# Altium schematic sheet Sensor_Box_CAN_Switch_STM.SchDoc: Title
size 420 x 297 mm; Author: G.Kasprowicz; CompanyName: WUT ISE; DrawnBy: G.Kasprowicz; Organization: WUT ISE; Address1: PW ISE; Address2: Nowowiejska 15/19 00-665 Warsaw; Address3: gkasprow@gmail.com; Revision: 1.0; SheetNumber: -; SheetTotal: -; ModifiedBy: -; CheckedDate: -; Title2: Title2; DivGrp: WUT ISE; Designer: G.Kasprowicz; ModifiedDate: -; ProjectName: Sensor Box
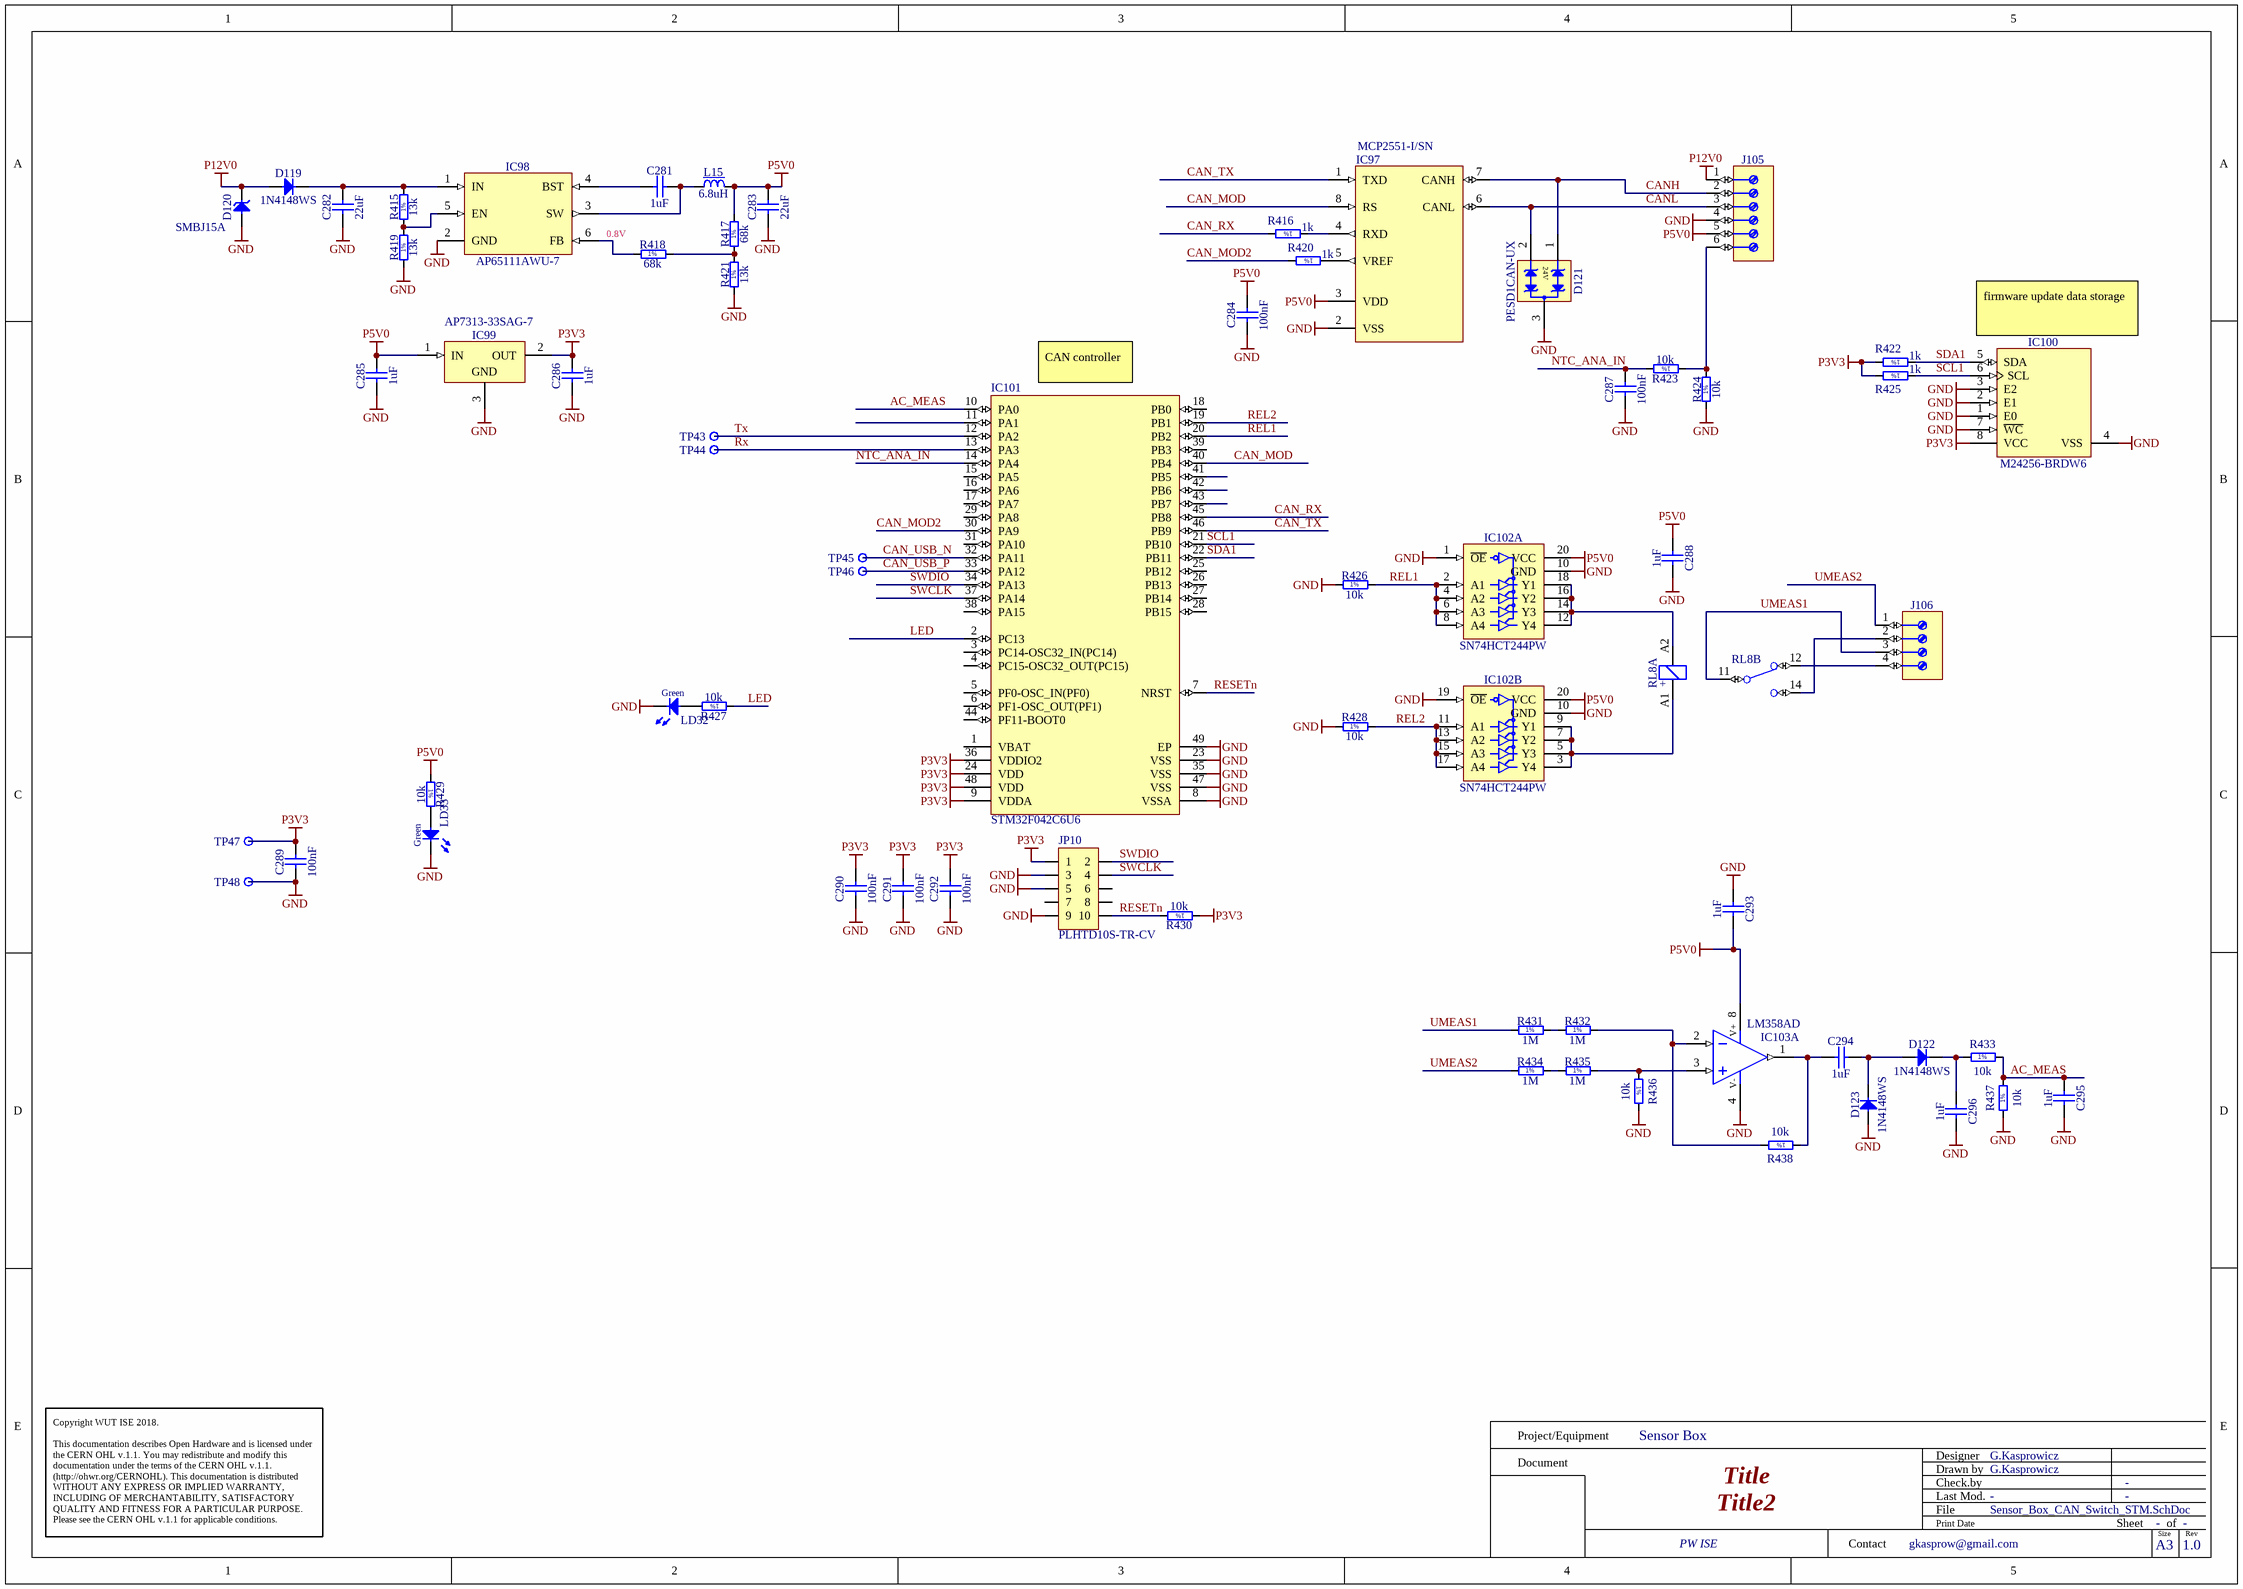
[diagram p0: Sensor_Box_CAN_Switch_STM.SchDoc]

## Parts
C281  1uF  [CAPC1005X55N]
C282  22uF  [CAPC1709X100N]
C283  22uF  [CAPC1709X100N]
C284  100nF  [CAPC1005X55N]
C285  1uF  [CAPC1005X55N]
C286  1uF  [CAPC1005X55N]
C287  100nF  [CAPC1005X55N]
C288  1uF  [CAPC1005X55N]
C289  100nF  [CAPC1005X55N]
C290  100nF  [CAPC1005X55N]
C291  100nF  [CAPC1005X55N]
C292  100nF  [CAPC1005X55N]
C293  1uF  [CAPC1005X55N]
C294  1uF  [CAPC1005X55N]
C295  1uF  [CAPC1005X55N]
C296  1uF  [CAPC1005X55N]
D119  1N4148WS  [SODFL2512X100N]
D120  SMBJ15A  [DIOM5336X265N]
D121  PESD1CAN-UX  [SOT95P237X112-3N]
D122  1N4148WS  [SODFL2512X100N]
D123  1N4148WS  [SODFL2512X100N]
IC97  MCP2551-I/SN  [SOIC127P600X175-8N]
IC98  AP65111AWU-7  [SOT95P280X100-6N]
IC99  AP7313-33SAG-7  [SOT95P240X130-3N]
IC100  M24256-BRDW6  [SOP65P640X120-8N]
IC101  STM32F042C6U6  [STM-UFQFPN48_L]
IC102  SN74HCT244PW  [SOP65P640X120-20N]  (parts A,B of 2)
IC103  LM358AD  [SOIC127P600X175-8N]  (part A of 2)
J105  (no value)  [PHOENIX_1725698]
J106  (no value)  [TYCO_282836-4]
JP10  PLHTD10S-TR-CV  [PLHTD10S-TR-CV]
L15  6.8uH  [IND_WALSIN_WLPN3030]
LD32  Green  [LED_KINGBRIGHT_KPH-1608CGCK]
LD33  Green  [LED_KINGBRIGHT_KPH-1608CGCK]
R415  13k  [RESC1005X40N]
R416  1k  [RESC1005X40N]
R417  68k  [RESC1005X40N]
R418  68k  [RESC1005X40N]
R419  13k  [RESC1005X40N]
R420  1k  [RESC1005X40N]
R421  13k  [RESC1005X40N]
R422  1k  [RESC1005X40N]
R423  10k  [RESC1005X40N]
R424  10k  [RESC1005X40N]
R425  1k  [RESC1005X40N]
R426  10k  [RESC1005X40N]
R427  10k  [RESC1005X40N]
R428  10k  [RESC1005X40N]
R429  10k  [RESC1005X40N]
R430  10k  [RESC1005X40N]
R431  1M  [RESC3216X65N]
R432  1M  [RESC3216X65N]
R433  10k  [RESC1005X40N]
R434  1M  [RESC3216X65N]
R435  1M  [RESC3216X65N]
R436  10k  [RESC1005X40N]
R437  10k  [RESC1005X40N]
R438  10k  [RESC1005X40N]
RL8  REL_TYCO_PE01  [REL_TYCO_PE01]  (value not drawn)  (parts A,B of 2)
TP43  Test Point  [TPS127]  (value not drawn)
TP44  Test Point  [TPS127]  (value not drawn)
TP45  Test Point  [TPS127]  (value not drawn)
TP46  Test Point  [TPS127]  (value not drawn)
TP47  Test Point  [TPS127]  (value not drawn)
TP48  Test Point  [TPS127]  (value not drawn)

## Nets
GND: C282.1 C283.1 C284.1 C285.1 C286.1 C287.1 C288.2 C289.1 C290.1 C291.1 C292.1 C293.1 C295.2 C296.2 D120.2(A) D121.3(GND) D123.2(A) IC97.2(VSS) IC98.2(GND) IC99.3(GND) IC100.1(E0) IC100.2(E1) IC100.3(E2) IC100.4(VSS) IC100.7(~{WC}) IC101.8(VSSA) IC101.23(VSS) IC101.35(VSS) IC101.47(VSS) IC101.49(EP) IC102.1(~{OE}) IC102.10(GND) IC102.19(~{OE}) IC103.4(V-) J105.4 JP10.3 JP10.5 JP10.9 LD32.1(C) LD33.1(C) R419.1 R421.1 R424.1 R426.1 R428.1 R436.2 R437.1 TP48.1
P3V3: C286.2 C289.2 C290.2 C291.2 C292.2 IC99.2(OUT) IC100.8(VCC) IC101.9(VDDA) IC101.24(VDD) IC101.36(VDDIO2) IC101.48(VDD) JP10.1 R422.2 R425.2 R430.1 TP47.1
P5V0: C283.2 C284.2 C285.2 C288.1 C293.2 IC97.3(VDD) IC99.1(IN) IC102.20(VCC) IC103.8(V+) J105.5 L15.2 R417.2 R429.1
P12V0: D119.2(A) D120.1(C) J105.1
AC_MEAS: C295.1 IC101.10(PA0) R433.2 R437.2
CAN_MOD: IC97.8(RS) IC101.40(PB4)
CAN_MOD2: IC101.30(PA9) R420.2
CAN_RX: IC101.45(PB8) R416.2
CAN_TX: IC97.1(TXD) IC101.46(PB9)
CAN_USB_N: IC101.32(PA11) TP45.1
CAN_USB_P: IC101.33(PA12) TP46.1
CANH: D121.1(I/O1) IC97.7(CANH) J105.2
CANL: D121.2(I/O2) IC97.6(CANL) J105.3
LED: IC101.2(PC13) R427.1
NTC_ANA_IN: C287.2 IC101.14(PA4) R423.2
REL1: IC101.20(PB2) IC102.2(A1) IC102.4(A2) IC102.6(A3) IC102.8(A4) R426.2
REL2: IC101.19(PB1) IC102.11(A1) IC102.13(A2) IC102.15(A3) IC102.17(A4) R428.2
RESETn: IC101.7(NRST) JP10.10 R430.2
Rx: IC101.13(PA3) TP44.1
SCL1: IC100.6(SCL) IC101.21(PB10) R425.1
SDA1: IC100.5(SDA) IC101.22(PB11) R422.1
SWCLK: IC101.37(PA14) JP10.4
SWDIO: IC101.34(PA13) JP10.2
Tx: IC101.12(PA2) TP43.1
UMEAS1: J106.3 R431.1 RL8.11(C)
UMEAS2: J106.1 R434.1
NetC281_1: C281.1 IC98.4(BST)
NetC281_2: C281.2 IC98.3(SW) L15.1
NetC282_2: C282.2 D119.1(C) IC98.1(IN) R415.2
NetC294_1: C294.1 IC103.1(OUT) R438.1
NetC294_2: C294.2 D122.2(A) D123.1(C)
NetC296_1: C296.1 D122.1(C) R433.1
NetIC97_4: IC97.4(RXD) R416.1
NetIC97_5: IC97.5(VREF) R420.1
NetIC98_5: IC98.5(EN) R415.1 R419.2
NetIC98_6: IC98.6(FB) R418.1
NetIC102_3: IC102.3(Y4) IC102.5(Y3) IC102.7(Y2) IC102.9(Y1) RL8.A1
NetIC102_12: IC102.12(Y4) IC102.14(Y3) IC102.16(Y2) IC102.18(Y1) RL8.A2
NetIC103_2: IC103.2(IN-) R432.2 R438.2
NetIC103_3: IC103.3(IN+) R435.2 R436.1
NetJ105_6: J105.6 R423.1 R424.2
NetJ106_2: J106.2 RL8.14(NO)
NetJ106_4: J106.4 RL8.12(NC)
NetLD32_2: LD32.2(A) R427.2
NetLD33_2: LD33.2(A) R429.2
NetR417_1: R417.1 R418.2 R421.2
NetR431_2: R431.2 R432.1
NetR434_2: R434.2 R435.1

Not connected (* = marked no-connect by the designer): IC101 1(VBAT) 3(PC14-OSC32_IN(PC14)) 4(PC15-OSC32_OUT(PC15)) 5(PF0-OSC_IN(PF0)) 6(PF1-OSC_OUT(PF1)) 11(PA1) 15(PA5) 16(PA6) 17(PA7) 18(PB0) 25(PB12) 26(PB13) 27(PB14) 28(PB15) 29(PA8) 31(PA10) 38(PA15) 39(PB3) 41(PB5) 42(PB6) 43(PB7) 44(PF11-BOOT0); JP10 6 7 8

## Notes on the sheet
- 0.8V
- (near IC101) CAN controller
- (near IC100) firmware update data storage
- Project/Equipment
- Document
- Designer
- Drawn by
- Check.by
- Copyright WUT ISE 2018.
  This documentation describes Open Hardware and is licensed under the CERN OHL v.1.1. You may redistribute and modify this documentation under the terms of the CERN OHL v.1.1. (http://ohwr.org/CERNOHL). This documentation is distributed WITHOUT ANY EXPRESS OR IMPLIED WARRANTY, INCLUDING OF MERCHANTABILITY, SATISFACTORY QUALITY AND FITNESS FOR A PARTICULAR PURPOSE. Please see the CERN OHL v.1.1 for applicable conditions.
- Contact
- File
- Last Mod.
- Print Date
- Sheet
- Size
- A3
- of
- Rev
- (in symbol R0402_1K_1%_0.0625W_100PPM) 1%
- (in symbol R0402_10K_1%_0.0625W_100PPM) 1%
- (in symbol R0402_13K_1%_0.0625W_100PPM) 1%
- (in symbol R0402_68K_1%_0.0625W_100PPM) 1%
- (in symbol R1206_1M_1%_0.25W_100PPM) 1%
- (in symbol REL_TYCO_PE014F05, part A) +

## Library data of the parts
C281 C285 C286 C288 C293-C296 = CC0402_1UF_16V_10%_X5R: Non-polarised capacitor; Part Description: SMD Multilayer Chip Ceramic Capacitor; Manufacturer: GENERIC; Manufacturer1 Part Number: C1005X5R1C105KT; Voltage: 16V; TC: X5R; Tolerance: ±10%; Part Number: CC0402_1UF_16V_10%_X5R; Component Kind: Standard; Component Type: Standard; Pin Count: 2; Value: 1uF; Status: Preferred; Manufacturer Part Number: CC0402_1UF_16V_10%_X5R; Case: 0402; Mounted: Yes; Socket: No; SMD: Yes; Sense: No; Manufacturer1 Example: TDK; Manufacturer1 ComponentHeight: 0.55mm; HelpURL: \\cern.ch\dfs\Applications\Altium\Datasheets\CC0402_X5R_TDK_C.pdf; Author: CERN DEM JLC; CreateDate: 25.10.2012; LatestRevisionDate: 25.10.2012
C282 C283 = CC0603_22UF_6.3V_20%_X5R: Non-polarised capacitor; Part Description: SMD Multilayer Chip Ceramic Capacitor; Manufacturer: GENERIC; Manufacturer1 Part Number: C1608X5R0J226M080AC; Voltage: 6.3V; TC: X5R; Tolerance: ±20%; Part Number: CC0603_22UF_6.3V_20%_X5R; Component Kind: Standard; Component Type: Standard; Pin Count: 2; Value: 22uF; Status: None; Manufacturer Part Number: CC0603_22UF_6.3V_20%_X5R; Case: 0603; Mounted: Yes; Socket: No; SMD: Yes; Sense: No; Manufacturer1 Example: TDK; Manufacturer1 ComponentHeight: 1mm; HelpURL: \\cern.ch\dfs\Applications\Altium\Datasheets\CC0603_X5R_TDK_C.pdf; Author: CERN DEM JLC; CreateDate: 16.12.2013; LatestRevisionDate: 13.09.2016
C284 C287 C289-C292 = CC0402_100NF_16V_10%_X5R: Non-polarised capacitor; Part Description: SMD Multilayer Chip Ceramic Capacitor; Manufacturer: GENERIC; Manufacturer1 Part Number: GRM155R61C104KA88D; Voltage: 16V; TC: X5R; Tolerance: ±10%; Part Number: CC0402_100NF_16V_10%_X5R; Component Kind: Standard; Component Type: Standard; Pin Count: 2; Value: 100nF; Status: None; Manufacturer Part Number: CC0402_100NF_16V_10%_X5R; Case: 0402; Mounted: Yes; Socket: No; SMD: Yes; Sense: No; Manufacturer1 Example: MURATA; Manufacturer1 ComponentHeight: 0.55mm; HelpURL: \\cern.ch\dfs\Applications\Altium\Datasheets\CC0402_X5R_MURATA_GRM.pdf; Author: CERN DEM JLC; CreateDate: 10.12.2013; LatestRevisionDate: 10.12.2013
D119 D122 D123 = 1N4148WS: Diode; Part Description: Small Signal Diodes; Manufacturer: FAIRCHILD SEMICONDUCTOR; Voltage: 75V; Power: 150mA; PressFit: No; Bonding: No; Part Number: 1N4148WS; Component Kind: Standard; Component Type: Standard; Device: 1N4148WS; PackageDescription: SODFL Diode; 1.70mm W X 1.25mm L X 1.00mm H body, IPC Medium Density; Manufacturer Part Number: 1N4148WS; Pin Count: 2; Case: SOD-323F; Mounted: Yes; Socket: No; SMD: Yes; Sense: No; ComponentHeight: 1mm; HelpURL: \\cern.ch\dfs\Applications\Altium\Datasheets\1N4148WS.pdf; Author: CERN DEM JLC; CreateDate: 12.05.2011; LatestRevisionDate: 12.05.2011
D120 = SMBJ15A: Zener Diode; Part Description: Uni-Directional Transient Voltage Suppressor Diode; Manufacturer: FAIRCHILD SEMICONDUCTOR; Voltage: 15V; Power: 600W; PressFit: No; Bonding: No; Part Number: SMBJ15A; Component Kind: Standard; Component Type: Standard; Device: SMBJ15A; PackageDescription: DO-214-AA/SMB Diode, Molded Body; 5.34mm L X 3.625mm W X 2.65mm H, IPC Medium Density; Manufacturer Part Number: SMBJ15A; Pin Count: 2; Case: DO-214AA; Mounted: Yes; Socket: No; SMD: Yes; Sense: No; ComponentHeight: 2.65mm; HelpURL: \\cern.ch\dfs\Applications\Altium\Datasheets\SMBJ.pdf; Author: CERN DEM JLC; CreateDate: 08.12.2008; LatestRevisionDate: 19.12.2011
D121 = D_TVS_PESD1CAN: TVS Diode for CAN; Manufacturer: Nexperia; Voltage: 24V; Power: 400W; PressFit: No; Bonding: No; Part Number: PESD1CAN-UX; Component Kind: Standard; Component Type: Standard; Device: PESD1CAN-UX; PackageDescription: SOT, 0.95mm, pitch; 3 pin,1.30mm W X 2.92mm L X 1.12mm H body, IPC Medium Density; Part Description: TVS Diode for CAN; Manufacturer Part Number: PESD1CAN-UX; Pin Count: 3; Case: SOT-23; Mounted: Yes; Socket: No; SMD: Yes; Sense: No; ComponentHeight: 1.12mm; HelpURL: \\cern.ch\dfs\Applications\Altium\Datasheets\SM712.TCT.pdf; Author: CERN DEM JLC; CreateDate: 03.09.2014; LatestRevisionDate: 13.01.2015
IC97 = IFC_MCP2551: High-Speed CAN Transceiver, 8-Pin SOIC, Industrial Temperature; Manufacturer: MICROCHIP TECHNOLOGY; PressFit: No; Bonding: No; Part Number: MCP2551-I/SN; Component Kind: Standard; Component Type: Standard; Device: MCP2551-I/SN; PackageDescription: SOIC 8, Pitch 1.27mm - Body 4x5mm, IPC Medium Density; Part Description: High-Speed CAN Transceiver; Manufacturer Part Number: MCP2551-I/SN; Pin Count: 8; Case: SOIC8; Mounted: Yes; Socket: No; SMD: Yes; Sense: No; ComponentHeight: 1.75mm; Author: GK; CreateDate: 07.09.2016; LatestRevisionDate: 07.09.2016
IC98 = AP65111AWU-7: Light Load Improved 1.5A Synch DC/DC Buck Converter; Manufacturer: DIODES INCORPORATED; PressFit: No; Bonding: No; Part Number: AP65111AWU-7; Component Kind: Standard; Component Type: Standard; Device: AP65111AWU-7; PackageDescription: SOT23, 0.95mm pitch; 6 pin, 1.625mm W X 2.90mm L X 1.00mm H body, IPC Medium Density; Part Description: Light Load Improved 1.5A Synch DC/DC Buck Converter; Manufacturer Part Number: AP65111AWU-7; Pin Count: 6; Case: SOT23-6; Mounted: Yes; Socket: No; SMD: Yes; Sense: No; ComponentHeight: 1.1mm; HelpURL: \\cern.ch\dfs\Applications\Altium\Datasheets\AP65111AWU-7.pdf; Author: CERN DEM JLC; CreateDate: 20.03.2018; LatestRevisionDate: 20.03.2018
IC99 = AP7313-33SAG-7: 3-Terminal Regulator 1=IN 2=OUT 3=GND; Part Description: 3.3V, 150mA Low Quiescent Current, Fast Transient Low Dropout Linear Regulator; Manufacturer: DIODES INCORPORATED; PressFit: No; Bonding: No; Part Number: AP7313-33SAG-7; Component Kind: Standard; Component Type: Standard; Device: AP7313-33SAG-7; PackageDescription: SOT23 3-Leads, Pitch 0.95mm - Body 1.3x2.9mm, IPC Medium Density; Manufacturer Part Number: AP7313-33SAG-7; Pin Count: 3; Case: SOT23; Mounted: Yes; Socket: No; SMD: Yes; Sense: No; ComponentHeight: 1.35mm; HelpURL: \\cern.ch\dfs\Applications\Altium\Datasheets\AP7313-33SAG-7.pdf; Author: CERN DEM JLC; CreateDate: 20.03.2018; LatestRevisionDate: 20.03.2018
IC100 = MEM_M24256-BRDW6P: 256-Kbit Serial I²C Bus EEPROM; Manufacturer: ST MICROELECTRONICS; PressFit: No; Bonding: No; Part Number: M24256-BRDW6P; Component Kind: Standard; Component Type: Standard; Device: M24256-BRDW6; PackageDescription: SOP, 0.65mm pitch; 8 pin, 4.40mm W X 3.00mm L X 1.20mm H body, IPC Medium Density; Part Description: 256-Kbit Serial I²C Bus EEPROM; Manufacturer Part Number: M24256-BRDW6; Pin Count: 8; Case: TSSOP8; Mounted: Yes; Socket: No; SMD: Yes; Sense: No; ComponentHeight: 1.2mm; HelpURL: \\cern.ch\dfs\Applications\Altium\Datasheets\M24256-BRDW6P.pdf; Author: CERN DEM MR; CreateDate: 17.03.2016; LatestRevisionDate: 17.03.2016
IC101 = CMP-0304-00104-1: ARM Cortex-M0 32-bit MCU, 32 KB Flash, 6 KB Internal RAM, 38 I/Os, 48-Pin UFQFPN, -40 to 85 degC, Tray; Internal RAM Size (kB): 6; Supply Voltage(Vcc) min (V): 2; I/Os (High Current): 38; FLASH Size (Prog) (kB): 32; Operating Frequency(F) (Processor speed) (MHz): 48; ComponentLink2Description: Datasheet; Mounting Technology: Surface Mount; ComponentLink1Description: Manufacturer URL; ComponentLink1URL: http://www.st.com/; Core: ARM Cortex-M0; Package Reference: UFQFPN48; Packing: Tray; ComponentLink2URL: http://www.st.com/st-web-ui/static/active/en/resource/technical/document/datasheet/DM00105814.pdf; DatasheetVersion: Rev. 5; Package Description: 48-Pin Ultra Thin Fine Pitch Quad Flat No-Lead, 7 x 7 x 0.6 mm Body, 0.5 mm Pitch, Exposed Pad
IC102 = SN74HCT244PW: Octal Buffer/Driver with 3-State Ouputs; Part Description: Octal Buffer And Line Driver with 3-State Ouputs; Manufacturer: TEXAS INSTRUMENTS; PressFit: No; Bonding: No; Part Number: SN74HCT244PW; Component Kind: Standard; Component Type: Standard; Device: SN74HCT244PW; PackageDescription: SOP, 20-Leads, Body 6.5x4.4mm, Pitch 0.65mm, IPC Medium Density; Manufacturer Part Number: SN74HCT244PW; Pin Count: 20; Case: TSSOP20; Mounted: Yes; Socket: No; SMD: Yes; Sense: No; ComponentHeight: 1.2mm; Author: CERN DEM JLC; HelpURL: \\cern.ch\dfs\Applications\Altium\Datasheets\SN74HCT244PW.pdf; CreateDate: 11.10.2011; LatestRevisionDate: 11.10.2011
IC103 = LM358AD: Dual Operational Amplifier; Manufacturer: TEXAS INSTRUMENTS; PressFit: No; Bonding: No; Part Number: LM358AD; Component Kind: Standard; Component Type: Standard; Device: LM358AD; PackageDescription: SOIC 8, Pitch 1.27mm - Body 4x5mm, IPC Medium Density; Part Description: Dual Operational Amplifier; Manufacturer Part Number: LM358AD; Pin Count: 8; Case: SOIC8; Mounted: Yes; Socket: No; SMD: Yes; Sense: No; ComponentHeight: 1.75mm; Author: CERN DEM JLC; HelpURL: \\cern.ch\dfs\Applications\Altium\Datasheets\LM358AD.pdf; CreateDate: 02.12.2008; LatestRevisionDate: 13.04.2010
J105 = PHOENIX_1725698: Terminal Block, 6 Positions, Screw Connection; Part Description: 6A, 63V, Terminal Block, Pitch 2.54mm, 6 Positions, Screw Connection; Manufacturer: PHOENIX CONTACT; Manufacturer Part Number: 1725698 (MPT 0,5/6-2,54); PressFit: No; Part Number: PHOENIX_1725698; Component Kind: Standard; Component Type: Standard; Pin Count: 6; Mounted: Yes; Socket: No; SMD: No; Sense: No; Status: None; ComponentHeight: 8.5mm; HelpURL: \\cern.ch\dfs\Applications\Altium\Datasheets\PHOENIX_1725698.pdf; Author: CERN DEM JMW; CreateDate: 07.11.2008; LatestRevisionDate: 26.04.2010
J106 = TYCO_282836-4: Terminal Block, 4 Positions, Screw Connection; Part Description: 15.5A, 300V, Terminal Block, Pitch 5mm, 4 Positions, Screw Connection; Manufacturer: TYCO ELECTRONICS; PressFit: No; Part Number: TYCO_282836-4; Component Kind: Standard; Component Type: Standard; Pin Count: 4; Mounted: Yes; Socket: No; SMD: No; Sense: No; Status: None; Manufacturer Part Number: 282836-4; ComponentHeight: 10mm; HelpURL: \\cern.ch\dfs\Applications\Altium\Datasheets\TYCO_282836-4.pdf; Author: CERN DEM JLC; CreateDate: 10.11.2014; LatestRevisionDate: 10.11.2014
JP10 = CON_2x5 1.27 SMT Male: 1.27 mm dual row goldpin (Maritex)
L15 = IND_WLPN3030: 6,8uH; 900mA; 0,211Ω; 3x3x1,5mm; Part Number: IND_6.8UH_20%_WALSIN_WLPN303015M6R8PB; Part Description: Miniature Surface Mount Power Inductor (8200 Series); Manufacturer: WALSIN; Manufacturer Part Number: WLPN303015M6R8PB; Resistance: 0.21R; Tolerance: ±20%; Component Kind: Standard; Component Type: Standard; Pin Count: 2; Value: 6.8uH; Status: None; Power: 900mA; Mounted: Yes; Socket: No; SMD: Yes; Sense: No; ComponentHeight: 1.5; HelpURL: \\cern.ch\dfs\Applications\Altium\Datasheets\IND_MURATA-PS_8200.pdf; Author: GK; CreateDate: 11.07.2016; LatestRevisionDate: 11.07.2016
LD32 LD33 = LED_KINGBRIGHT_KPH-1608CGCK: LED Green 1C 2A; Part Description: SMD Green LED, Case 1.6mmX0.8mm(0603), 0.65mm Thickness; PressFit: No; Bonding: No; Part Number: LED_KINGBRIGHT_KPH-1608CGCK; Component Kind: Standard; Component Type: Standard; Color: Green; PackageDescription: SMT Green LED, Case 0603, Body L 1.6 x W 0.8mm H 0.65mm; Manufacturer: KINGBRIGHT; Manufacturer Part Number: KPH-1608CGCK; Pin Count: 2; Mounted: Yes; Socket: No; SMD: Yes; Sense: No; ComponentHeight: 0.65mm; HelpURL: \\cern.ch\dfs\Applications\Altium\Datasheets\LED_KINGBRIGHT_KPH-1608CGCK.pdf; Author: CERN DEM JLC; CreateDate: 03.07.2017; LatestRevisionDate: 03.07.2017
R415 R419 R421 = R0402_13K_1%_0.0625W_100PPM: Resistor - 1%; Part Description: General Purpose Thick Film Chip Resistor; Manufacturer: GENERIC; Manufacturer1 Part Number: 232270671303L; TC: ±100ppm/°C; PressFit: No; Part Number: R0402_13K_1%_0.0625W_100PPM; Component Kind: Standard; Component Type: Standard; Pin Count: 2; Value: 13k; Status: Not Recommended; Power: 0.0625W; Tolerance: ±1%; Manufacturer Part Number: R0402_13K_1%_0.0625W_100PPM; Case: 0402; Mounted: Yes; Sense: No; Socket: No; SMD: Yes; Manufacturer1 Example: YAGEO PHYCOMP; Manufacturer1 ComponentHeight: 0.4mm; HelpURL: \\cern.ch\dfs\Applications\Altium\Datasheets\R0402_Phycomp_RC0402.pdf; Author: CERN DEM JLC; CreateDate: 03.12.2007; LatestRevisionDate: 17.10.2012
R416 R420 R422 R425 = R0402_1K_1%_0.0625W_100PPM: Resistor - 1%; Part Description: General Purpose Thick Film Chip Resistor; Manufacturer: GENERIC; Manufacturer1 Part Number: 232270671002L; TC: ±100ppm/°C; PressFit: No; Part Number: R0402_1K_1%_0.0625W_100PPM; Component Kind: Standard; Component Type: Standard; Pin Count: 2; Value: 1k; Status: Not Recommended; Power: 0.0625W; Tolerance: ±1%; Manufacturer Part Number: R0402_1K_1%_0.0625W_100PPM; Case: 0402; Mounted: Yes; Sense: No; Socket: No; SMD: Yes; Manufacturer1 Example: YAGEO PHYCOMP; Manufacturer1 ComponentHeight: 0.4mm; HelpURL: \\cern.ch\dfs\Applications\Altium\Datasheets\R0402_Phycomp_RC0402.pdf; Author: CERN DEM JLC; CreateDate: 03.12.2007; LatestRevisionDate: 17.10.2012
R417 R418 = R0402_68K_1%_0.0625W_100PPM: Resistor - 1%; Part Description: General Purpose Thick Film Chip Resistor; Manufacturer: GENERIC; Manufacturer1 Part Number: 232270676803L; TC: ±100ppm/°C; PressFit: No; Part Number: R0402_68K_1%_0.0625W_100PPM; Component Kind: Standard; Component Type: Standard; Pin Count: 2; Value: 68k; Status: Not Recommended; Power: 0.0625W; Tolerance: ±1%; Manufacturer Part Number: R0402_68K_1%_0.0625W_100PPM; Case: 0402; Mounted: Yes; Sense: No; Socket: No; SMD: Yes; Manufacturer1 Example: YAGEO PHYCOMP; Manufacturer1 ComponentHeight: 0.4mm; HelpURL: \\cern.ch\dfs\Applications\Altium\Datasheets\R0402_Phycomp_RC0402.pdf; Author: CERN DEM JLC; CreateDate: 03.12.2007; LatestRevisionDate: 17.10.2012
R423 R424 R426-R430 = R0402_10K_1%_0.0625W_100PPM: Resistor - 1%; Part Description: General Purpose Thick Film Chip Resistor; Manufacturer: GENERIC; Manufacturer1 Part Number: 232270671003L; TC: ±100ppm/°C; PressFit: No; Part Number: R0402_10K_1%_0.0625W_100PPM; Component Kind: Standard; Component Type: Standard; Pin Count: 2; Value: 10k; Status: Not Recommended; Power: 0.0625W; Tolerance: ±1%; Manufacturer Part Number: R0402_10K_1%_0.0625W_100PPM; Case: 0402; Mounted: Yes; Sense: No; Socket: No; SMD: Yes; Manufacturer1 Example: YAGEO PHYCOMP; Manufacturer1 ComponentHeight: 0.4mm; HelpURL: \\cern.ch\dfs\Applications\Altium\Datasheets\R0402_Phycomp_RC0402.pdf; Author: CERN DEM JLC; CreateDate: 03.12.2007; LatestRevisionDate: 17.10.2012
R431 R432 R434 R435 = R1206_1M_1%_0.25W_100PPM: Resistor - 1%; Part Description: General Purpose Thick Film Chip Resistor; Manufacturer: GENERIC; Manufacturer1 Part Number: NRC12F1004TRF; Power: 0.25W; TC: ±100ppm/°C; PressFit: No; Part Number: R1206_1M_1%_0.25W_100PPM; Component Kind: Standard; Component Type: Standard; Pin Count: 2; Value: 1M; Status: Preferred; Tolerance: ±1%; Manufacturer Part Number: R1206_1M_1%_0.25W_100PPM; Case: 1206; Mounted: Yes; Sense: No; Socket: No; SMD: Yes; Manufacturer1 Example: NIC COMPONENT; Manufacturer1 ComponentHeight: 0.65mm; HelpURL: \\cern.ch\dfs\Applications\Altium\Datasheets\R1206_NIC_NRC.pdf; Author: CERN DEM JLC; CreateDate: 03.12.2007; LatestRevisionDate: 13.03.2008
R433 R436-R438 = R0402_10K_1%_0.0625W_100PPM: Resistor - 1%; Part Description: General Purpose Thick Film Chip Resistor; Manufacturer: GENERIC; Manufacturer1 Part Number: 232270671003L; TC: ±100ppm/°C; Table: Resistors SMD; Part Number: R0402_10K_1%_0.0625W_100PPM; Component Kind: Standard; Component Type: Standard; Pin Count: 2; Value: 10k; Status: Not recommended; Power: 0.0625W; Tolerance: ±1%; Manufacturer Part Number: R0402_10K_1%_0.0625W_100PPM; Case: 0402; Mounted: Yes; Socket: No; SMD: Yes; Manufacturer1 Example: YAGEO PHYCOMP; Manufacturer1 ComponentHeight: 0.4mm; HelpURL: \\cern.ch\dfs\Applications\Altium\Datasheets\R0402_Phycomp_RC0402.pdf; Author: CERN DEM JLC; CreateDate: 2007-12-03; LatestRevisionDate: 2012-10-17
RL8 = REL_TYCO_PE014F05: 1 form C (CO) General Purpose Low Power PCB Relay, PE Series; Part Description: 5A/250VAC 1 form C (CO) General Purpose Low Power PCB Relay, PE Series; Manufacturer: TYCO SCHRACK; Manufacturer Part Number: PE014F05 or 1-1415390-1; PressFit: No; Value: 5VDC; Part Number: REL_TYCO_PE014F05; Component Kind: Standard; Component Type: Standard; Pin Count: 5; PackageDescription: 1 form C (CO) General Purpose Low Power PCB Relay, PE Series, Body 20mm x 10mm; Mounted: Yes; Socket: No; SMD: No; Sense: No; Status: None; ComponentHeight: 10mm; HelpURL: \\cern.ch\dfs\Applications\Altium\Datasheets\REL_TYCO_PE014F05.pdf; Author: CERN DEM JLC; CreateDate: 20.03.2018; LatestRevisionDate: 20.03.2018
TP43-TP48 = SMD_PAD_1.27X1.27MM: Part Description: 1.27mm x 1.27mm PCB Copper Area (SMD Test Point); Mounted: No; Part Number: SMD_PAD_1.27X1.27MM; Component Kind: Standard (No BOM); Component Type: Standard (No BOM); Pin Count: 1; Family: Test Point; Socket: No; SMD: Yes; Sense: No; Status: None; ComponentHeight: 0mm; HelpURL: Undefined; Author: CERN DEM JLC; CreateDate: 12.01.2008; LatestRevisionDate: 12.01.2008; PackageDescription: 1.27mm x 1.27mm PCB Copper Area (SMD Test Point)